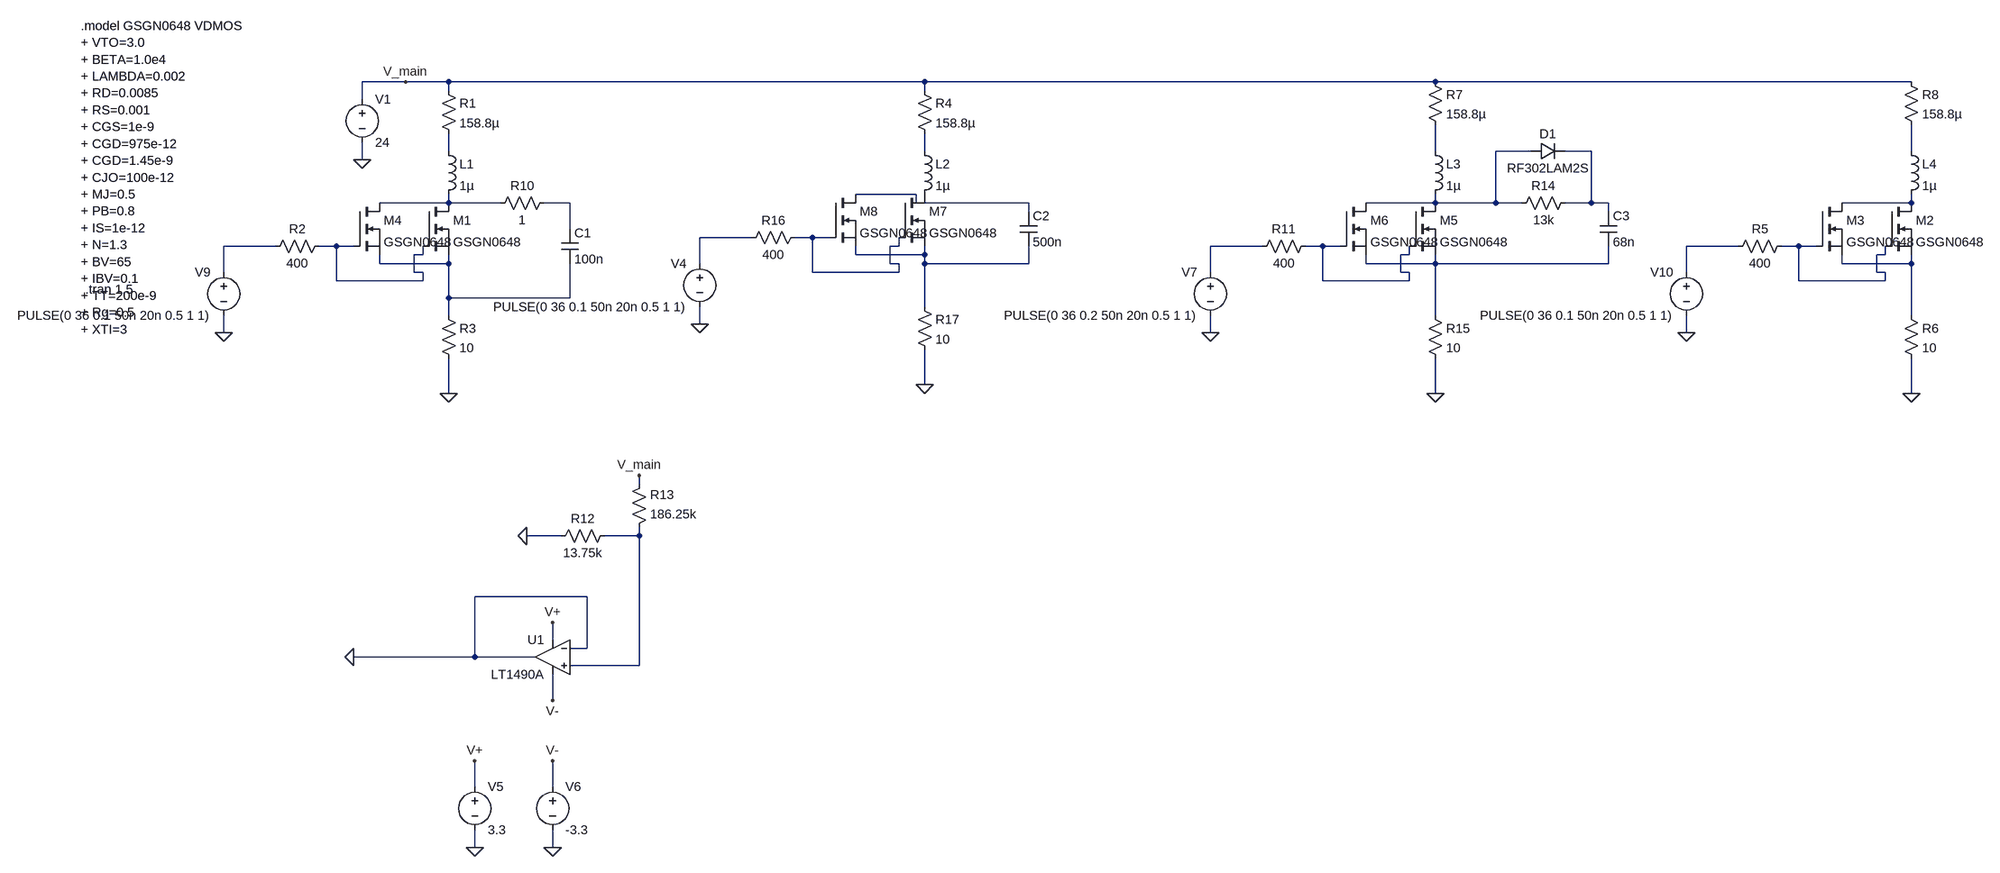
[diagram p0: schematic Snubber_Network.asc]
Snubber_Network.asc, the LTspice schematic file:
Version 4
SHEET 1 3520 1648
WIRE 480 -64 400 -64
WIRE 560 -64 480 -64
WIRE 1440 -64 560 -64
WIRE 2384 -64 1440 -64
WIRE 3264 -64 2384 -64
WIRE 560 -48 560 -64
WIRE 1440 -48 1440 -64
WIRE 400 -32 400 -64
WIRE 560 64 560 32
WIRE 1440 64 1440 32
WIRE 2384 64 2384 16
WIRE 2560 64 2496 64
WIRE 2672 64 2624 64
WIRE 3264 64 3264 16
WIRE 400 80 400 48
WIRE 1424 144 1312 144
WIRE 560 160 560 144
WIRE 560 160 432 160
WIRE 656 160 560 160
WIRE 784 160 736 160
WIRE 1424 160 1424 144
WIRE 1632 160 1424 160
WIRE 2384 160 2384 144
WIRE 2384 160 2256 160
WIRE 2496 160 2496 64
WIRE 2496 160 2384 160
WIRE 2544 160 2496 160
WIRE 2672 160 2672 64
WIRE 2672 160 2624 160
WIRE 2704 160 2672 160
WIRE 3264 160 3264 144
WIRE 3264 160 3136 160
WIRE 1632 176 1632 160
WIRE 2704 176 2704 160
WIRE 784 208 784 160
WIRE 1120 224 1024 224
WIRE 1232 224 1200 224
WIRE 1264 224 1232 224
WIRE 240 240 144 240
WIRE 352 240 320 240
WIRE 384 240 352 240
WIRE 1392 240 1392 224
WIRE 1392 240 1376 240
WIRE 2064 240 1968 240
WIRE 2176 240 2144 240
WIRE 2208 240 2176 240
WIRE 2944 240 2848 240
WIRE 3056 240 3024 240
WIRE 3088 240 3056 240
WIRE 512 256 512 240
WIRE 512 256 496 256
WIRE 1312 256 1312 240
WIRE 1440 256 1440 240
WIRE 1440 256 1312 256
WIRE 2336 256 2336 240
WIRE 2336 256 2320 256
WIRE 3216 256 3216 240
WIRE 3216 256 3200 256
WIRE 432 272 432 256
WIRE 560 272 560 256
WIRE 560 272 432 272
WIRE 1024 272 1024 224
WIRE 1376 272 1376 240
WIRE 1392 272 1376 272
WIRE 1440 272 1440 256
WIRE 1632 272 1632 240
WIRE 1632 272 1440 272
WIRE 2256 272 2256 256
WIRE 2384 272 2384 256
WIRE 2384 272 2256 272
WIRE 2704 272 2704 240
WIRE 2704 272 2384 272
WIRE 3136 272 3136 256
WIRE 3264 272 3264 256
WIRE 3264 272 3136 272
WIRE 144 288 144 240
WIRE 496 288 496 256
WIRE 512 288 496 288
WIRE 1232 288 1232 224
WIRE 1392 288 1392 272
WIRE 1392 288 1232 288
WIRE 1968 288 1968 240
WIRE 2320 288 2320 256
WIRE 2336 288 2320 288
WIRE 2848 288 2848 240
WIRE 3200 288 3200 256
WIRE 3216 288 3200 288
WIRE 352 304 352 240
WIRE 512 304 512 288
WIRE 512 304 352 304
WIRE 2176 304 2176 240
WIRE 2336 304 2336 288
WIRE 2336 304 2176 304
WIRE 3056 304 3056 240
WIRE 3216 304 3216 288
WIRE 3216 304 3056 304
WIRE 560 336 560 272
WIRE 784 336 784 272
WIRE 784 336 560 336
WIRE 1440 352 1440 272
WIRE 560 368 560 336
WIRE 2384 368 2384 272
WIRE 3264 368 3264 272
WIRE 1024 384 1024 352
WIRE 144 400 144 368
WIRE 1968 400 1968 368
WIRE 2848 400 2848 368
WIRE 1440 496 1440 432
WIRE 560 512 560 448
WIRE 2384 512 2384 448
WIRE 3264 512 3264 448
WIRE 912 960 912 944
WIRE 768 1056 704 1056
WIRE 912 1056 912 1040
WIRE 912 1056 848 1056
WIRE 816 1168 608 1168
WIRE 752 1248 752 1216
WIRE 816 1264 816 1168
WIRE 816 1264 784 1264
WIRE 608 1280 608 1168
WIRE 608 1280 384 1280
WIRE 720 1280 608 1280
WIRE 912 1296 912 1056
WIRE 912 1296 784 1296
WIRE 752 1360 752 1312
WIRE 608 1520 608 1472
WIRE 752 1520 752 1472
WIRE 608 1632 608 1600
WIRE 752 1632 752 1600
FLAG 560 512 0
FLAG 400 80 0
FLAG 144 400 0
FLAG 608 1632 0
FLAG 608 1472 V+
FLAG 752 1216 V+
FLAG 752 1632 0
FLAG 752 1472 V-
FLAG 752 1360 V-
FLAG 704 1056 0
FLAG 480 -64 V_main
FLAG 912 944 V_main
FLAG 384 1280 0
FLAG 2384 512 0
FLAG 1968 400 0
FLAG 1440 496 0
FLAG 1024 384 0
FLAG 3264 512 0
FLAG 2848 400 0
SYMBOL voltage 400 -48 R0
SYMATTR InstName V1
SYMATTR Value 24
SYMBOL Ind 544 48 R0
SYMATTR InstName L1
SYMATTR Value 1µ
SYMBOL Res 544 -64 R0
SYMATTR InstName R1
SYMATTR Value 158.8µ
SYMBOL Res 336 224 R90
WINDOW 0 0 56 VBottom 2
WINDOW 3 32 56 VTop 2
SYMATTR InstName R2
SYMATTR Value 400
SYMBOL nmos 512 160 R0
SYMATTR InstName M1
SYMATTR Value GSGN0648
SYMBOL Ind 1424 48 R0
SYMATTR InstName L2
SYMATTR Value 1µ
SYMBOL Res 1424 -64 R0
SYMATTR InstName R4
SYMATTR Value 158.8µ
SYMBOL Ind 2368 48 R0
SYMATTR InstName L3
SYMATTR Value 1µ
SYMBOL Res 2368 -80 R0
SYMATTR InstName R7
SYMATTR Value 158.8µ
SYMBOL LT1490A 752 1216 M0
SYMATTR InstName U1
SYMBOL voltage 608 1504 R0
SYMATTR InstName V5
SYMATTR Value 3.3
SYMBOL voltage 752 1504 R0
SYMATTR InstName V6
SYMATTR Value -3.3
SYMBOL Res 864 1040 R90
WINDOW 0 0 56 VBottom 2
WINDOW 3 32 56 VTop 2
SYMATTR InstName R12
SYMATTR Value 13.75k
SYMBOL Res 896 1056 M180
WINDOW 0 36 76 Left 2
WINDOW 3 36 40 Left 2
SYMATTR InstName R13
SYMATTR Value 186.25k
SYMBOL Res 752 144 R90
WINDOW 0 0 56 VBottom 2
WINDOW 3 32 56 VTop 2
SYMATTR InstName R10
SYMATTR Value 1
SYMBOL Cap 768 208 R0
SYMATTR InstName C1
SYMATTR Value 100n
SYMBOL Res 544 352 R0
SYMATTR InstName R3
SYMATTR Value 10
SYMBOL Cap 1616 176 R0
SYMATTR InstName C2
SYMATTR Value 500n
SYMBOL Cap 2688 176 R0
SYMATTR InstName C3
SYMATTR Value 68n
SYMBOL Res 2640 144 R90
WINDOW 0 0 56 VBottom 2
WINDOW 3 32 56 VTop 2
SYMATTR InstName R14
SYMATTR Value 13k
SYMBOL diode 2560 80 R270
WINDOW 0 32 32 VTop 2
WINDOW 3 0 32 VBottom 2
SYMATTR InstName D1
SYMATTR Value RF302LAM2S
SYMBOL nmos 384 160 R0
SYMATTR InstName M4
SYMATTR Value GSGN0648
SYMBOL voltage 1968 272 M0
SYMATTR InstName V7
SYMATTR Value PULSE(0 36 0.2 50n 20n 0.5 1 1)
SYMBOL Res 2160 224 R90
WINDOW 0 0 56 VBottom 2
WINDOW 3 32 56 VTop 2
SYMATTR InstName R11
SYMATTR Value 400
SYMBOL nmos 2336 160 R0
SYMATTR InstName M5
SYMATTR Value GSGN0648
SYMBOL Res 2368 352 R0
SYMATTR InstName R15
SYMATTR Value 10
SYMBOL nmos 2208 160 R0
SYMATTR InstName M6
SYMATTR Value GSGN0648
SYMBOL Res 1216 208 R90
WINDOW 0 0 56 VBottom 2
WINDOW 3 32 56 VTop 2
SYMATTR InstName R16
SYMATTR Value 400
SYMBOL nmos 1392 144 R0
SYMATTR InstName M7
SYMATTR Value GSGN0648
SYMBOL Res 1424 336 R0
SYMATTR InstName R17
SYMATTR Value 10
SYMBOL nmos 1264 144 R0
SYMATTR InstName M8
SYMATTR Value GSGN0648
SYMBOL Res 3040 224 R90
WINDOW 0 0 56 VBottom 2
WINDOW 3 32 56 VTop 2
SYMATTR InstName R5
SYMATTR Value 400
SYMBOL nmos 3216 160 R0
SYMATTR InstName M2
SYMATTR Value GSGN0648
SYMBOL Res 3248 352 R0
SYMATTR InstName R6
SYMATTR Value 10
SYMBOL nmos 3088 160 R0
SYMATTR InstName M3
SYMATTR Value GSGN0648
SYMBOL Ind 3248 48 R0
SYMATTR InstName L4
SYMATTR Value 1µ
SYMBOL Res 3248 -80 R0
SYMATTR InstName R8
SYMATTR Value 158.8µ
SYMBOL voltage 1024 256 M0
SYMATTR InstName V4
SYMATTR Value PULSE(0 36 0.1 50n 20n 0.5 1 1)
SYMBOL voltage 144 272 M0
SYMATTR InstName V9
SYMATTR Value PULSE(0 36 0.1 50n 20n 0.5 1 1)
SYMBOL voltage 2848 272 M0
SYMATTR InstName V10
SYMATTR Value PULSE(0 36 0.1 50n 20n 0.5 1 1)
TEXT -112 320 Left 2 !.tran 1.5
TEXT -120 -168 Left 2 !.model GSGN0648 VDMOS\n+ VTO=3.0\n+ BETA=1.0e4\n+ LAMBDA=0.002\n+ RD=0.0085\n+ RS=0.001\n+ CGS=1e-9\n+ CGD=975e-12\n+ CGD=1.45e-9\n+ CJO=100e-12\n+ MJ=0.5\n+ PB=0.8\n+ IS=1e-12\n+ N=1.3\n+ BV=65\n+ IBV=0.1\n+ TT=200e-9\n+ Rg=0.5\n+ XTI=3

The netlist it stands for:
* Snubber_Network.asc
V1 V_main 0 24
L1 N001 N008 1µ
R1 V_main N001 158.8µ
R2 N014 N013 400
M1 N008 N014 N020 N020 GSGN0648
L2 N002 P001 1µ
R4 V_main N002 158.8µ
L3 N003 N004 1µ
R7 V_main N003 158.8µ
* U1: LT1490A (symbol LT1490A not available, pins judged from their places): In+=N023 In-=0 V+=V+ V-=V- OUT=0
V5 V+ 0 3.3
V6 V- 0 -3.3
R12 N023 0 13.75k
R13 N023 V_main 186.25k
R10 N009 N008 1
C1 N009 N020 100n
R3 N020 0 10
C2 N007 N019 500n
C3 N005 N021 68n
R14 N005 N004 13k
D1 N004 N005 RF302LAM2S
M4 N008 N014 N020 N020 GSGN0648
V7 N015 0 PULSE(0 36 0.2 50n 20n 0.5 1 1)
R11 N016 N015 400
M5 N004 N016 N021 N021 GSGN0648
R15 N021 0 10
M6 N004 N016 N021 N021 GSGN0648
R16 N012 N011 400
M7 P001 N012 N019 N019 GSGN0648
R17 N019 0 10
M8 N007 N012 N019 N019 GSGN0648
R5 N018 N017 400
M2 N010 N018 N022 N022 GSGN0648
R6 N022 0 10
M3 N010 N018 N022 N022 GSGN0648
L4 N006 N010 1µ
R8 V_main N006 158.8µ
V4 N011 0 PULSE(0 36 0.1 50n 20n 0.5 1 1)
V9 N013 0 PULSE(0 36 0.1 50n 20n 0.5 1 1)
V10 N017 0 PULSE(0 36 0.1 50n 20n 0.5 1 1)
.model D D
.lib standard.dio
.model NMOS NMOS
.model PMOS PMOS
.lib standard.mos
.tran 1.5
.model GSGN0648 VDMOS
+ VTO=3.0
+ BETA=1.0e4
+ LAMBDA=0.002
+ RD=0.0085
+ RS=0.001
+ CGS=1e-9
+ CGD=975e-12
+ CGD=1.45e-9
+ CJO=100e-12
+ MJ=0.5
+ PB=0.8
+ IS=1e-12
+ N=1.3
+ BV=65
+ IBV=0.1
+ TT=200e-9
+ Rg=0.5
+ XTI=3
.backanno
.end